# Altium schematic sheet USB_UART.SchDoc
size A4
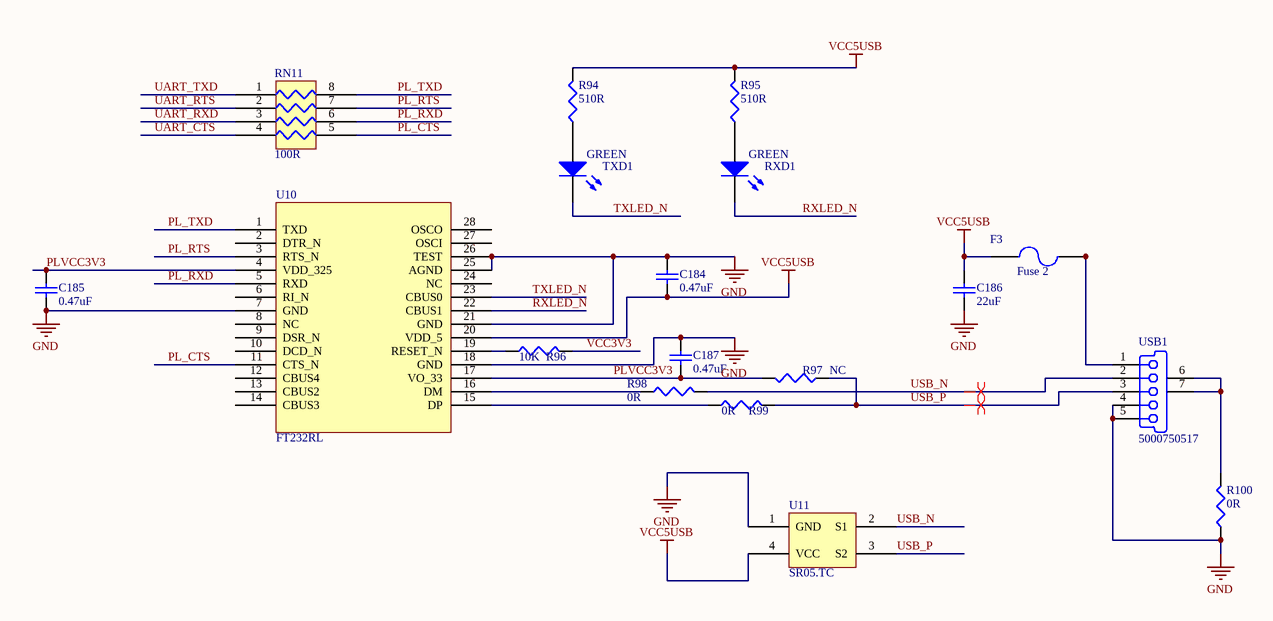
[diagram p0: USB_UART.SchDoc]

## Parts
C184  0.47uF  [CAPC1005N]
C185  0.47uF  [CAPC1005N]
C186  22uF  [CAPC3216N]
C187  0.47uF  [CAPC1005N]
F3  Fuse 2  [RESC3216N]
R94  510R  [RESC1005N]
R95  510R  [RESC1005N]
R96  10K  [RESC1005N]
R97  NC  [RESC1005N]
R98  0R  [RESC1005N]
R99  0R  [RESC1005N]
R100  0R  [RESC1608N]
RN11  100R  [EXBV8V]
RXD1  GREEN  [CD1608-0603]
TXD1  GREEN  [CD1608-0603]
U10  FT232RL  [SSOP28_N]
U11  SR05.TC  [SOT-143_N]
USB1  5000750517  [548190519]

## Nets
GND: C184.2 C185.1 C186.1 C187.2 R100.1 U10.7(GND) U10.18(GND) U10.21(GND) U10.25(AGND) U10.26(TEST) U11.1(GND) USB1.4(ID) USB1.5(GND)
VCC5USB: C184.1 C186.2 F3.1 R94.2 R95.2 U10.20(VDD_5) U11.4(VCC)
PL_CTS: RN11.5 U10.11(CTS_N)
PL_RTS: RN11.7 U10.3(RTS_N)
PL_RXD: RN11.6 U10.5(RXD)
PL_TXD: RN11.8 U10.1(TXD)
PLVCC3V3: C185.2 C187.1 R97.2 U10.4(VDD_325) U10.17(VO_33)
RXLED_N: RXD1.2(K) U10.22(CBUS1)
TXLED_N: TXD1.2(K) U10.23(CBUS0)
UART_CTS: RN11.4
UART_RTS: RN11.2
UART_RXD: RN11.3
UART_TXD: RN11.1
USB_N: R98.2 U11.2(S1) USB1.2(D-)
USB_P: R97.1 R99.2 U11.3(S2) USB1.3(D+)
VCC3V3: R96.2
NetF3_2: F3.2 USB1.1(V_BUS)
NetR94_1: R94.1 TXD1.1(A)
NetR95_1: R95.1 RXD1.1(A)
NetR96_1: R96.1 U10.19(RESET_N)
NetR98_1: R98.1 U10.16(DM)
NetR99_1: R99.1 U10.15(DP)
NetR100_2: R100.2 USB1.6(MH1) USB1.7(MH2)

Not connected (* = marked no-connect by the designer): U10 2(DTR_N) 6(RI_N) 8(NC) 9(DSR_N) 10(DCD_N) 12(CBUS4) 13(CBUS2) 14(CBUS3) 24(NC) 27(OSCI) 28(OSCO)

## Layout directives
differential pair: USB_N, USB_P

## Library data of the parts
C184-C187 = Cap Semi: Capacitor (Semiconductor SIM Model); Published: 8-Jun-2000; LatestRevisionDate: 29-May-2009; LatestRevisionNote: IPC-7351 Footprint Added.; PackageReference: C1206; Publisher: Altium Limited; PackageDescription: Chip Capacitor
  C184 C185 C187: Value: 0.47uF
  C186: Value: 22uF
F3 = Fuse 2: Fuse; Published: 8-Jun-2000; LatestRevisionDate: 17-Jul-2002; LatestRevisionNote: Re-released for DXP Platform.; PackageReference: PIN-W2/E2.8; Publisher: Altium Limited
R94-R100 = Res3: Resistor; Published: 8-Jun-2000; LatestRevisionDate: 29-May-2009; LatestRevisionNote: IPC-7351 Footprint Added.; PackageReference: J1-0603; Publisher: Altium Limited; PackageDescription: Chip Resistor
  R94 R95: Value: 510R
  R96: Value: 10K
  R97: Value: NC
  R98-R100: Value: 0R
RN11 = RES4PACK
RXD1 TXD1 = LED3: Typical BLUE SiC LED; Published: 8-Jun-2000; LatestRevisionDate: 17-Dec-2003; LatestRevisionNote: PCB Footprint replaced.; DatasheetVersion: 16-Apr-2002; PackageVersion: 16-Apr-2002; PackageReference: 3.5X2.8X1.9; Publisher: Altium Limited; PackageDescription: SM LED; 2 C-Bend Leads; Body 3.5 x 2.8 x 1.9 mm, inc leads (LxWxH typ)
U11 = SR05
USB1 = 5000750517: USB On-The-Go (OTG) Mini-B Receptacle, Right Angle, Thru-Hole, 0.80mm (.031") Pitch, Solder Tails & Shell Tabs with Dimples; PCB_Layout: Complies with Manufacturer's Recommendation.; Published: 30-May-2008; DatasheetVersion: rev0, Mar-2004; PackageVersion: rev0, Mar-2004; PackageReference: 5000750517; Publisher: Altium Limited; PackageDescription: USB Mini-B, Type 2, Thru-Hole; 5 Position; Vertical, Body 7.7 x 4.2 x 7.7 mm (LxWxH); ComponentLink1Description: Manufacturer Link; ComponentLink1URL: http://www.molex.com/; ComponentLink2Description: Datasheet; ComponentLink2URL: http://www.molex.com/pdm_docs/sd/5000750517_sd.pdf